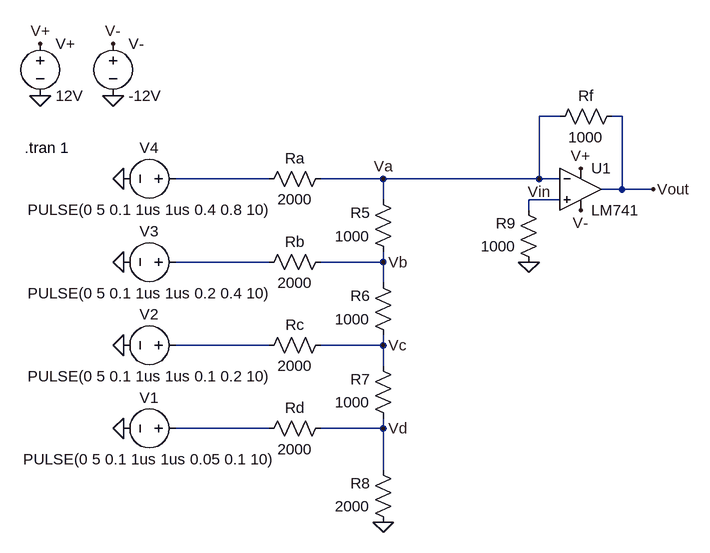
[diagram p0: schematic DAC_OpAmp.asc]
DAC_OpAmp.asc, the LTspice schematic file:
Version 4
SHEET 1 880 680
WIRE 560 -32 528 -32
WIRE 656 -32 640 -32
WIRE 112 64 -32 64
WIRE 288 64 192 64
WIRE 528 64 528 -32
WIRE 528 64 288 64
WIRE 560 64 528 64
WIRE 656 80 656 -32
WIRE 656 80 624 80
WIRE 704 80 656 80
WIRE 288 96 288 64
WIRE 560 96 512 96
WIRE 512 112 512 96
WIRE 112 192 -32 192
WIRE 288 192 288 176
WIRE 288 192 192 192
WIRE 288 224 288 192
WIRE 112 320 -32 320
WIRE 288 320 288 304
WIRE 288 320 192 320
WIRE 288 352 288 320
WIRE 112 448 -32 448
WIRE 288 448 288 432
WIRE 288 448 192 448
WIRE 288 512 288 448
FLAG 512 192 0
FLAG -240 -64 0
FLAG -128 -64 0
FLAG 288 592 0
FLAG -240 -144 V+
FLAG 592 48 V+
FLAG -128 -144 V-
FLAG 592 112 V-
FLAG 704 80 Vout
FLAG 288 64 Va
FLAG 288 192 Vb
FLAG 288 320 Vc
FLAG 288 448 Vd
FLAG -112 448 0
FLAG -112 320 0
FLAG -112 192 0
FLAG -112 64 0
FLAG 528 64 Vin
SYMBOL res 208 48 R90
WINDOW 0 0 56 VBottom 2
WINDOW 3 32 56 VTop 2
SYMATTR InstName Ra
SYMATTR Value 2000
SYMBOL res 208 176 R90
WINDOW 0 0 56 VBottom 2
WINDOW 3 32 56 VTop 2
SYMATTR InstName Rb
SYMATTR Value 2000
SYMBOL res 208 304 R90
WINDOW 0 0 56 VBottom 2
WINDOW 3 32 56 VTop 2
SYMATTR InstName Rc
SYMATTR Value 2000
SYMBOL res 208 432 R90
WINDOW 0 0 56 VBottom 2
WINDOW 3 32 56 VTop 2
SYMATTR InstName Rd
SYMATTR Value 2000
SYMBOL res 304 192 R180
WINDOW 0 36 76 Left 2
WINDOW 3 36 40 Left 2
SYMATTR InstName R5
SYMATTR Value 1000
SYMBOL res 304 320 R180
WINDOW 0 36 76 Left 2
WINDOW 3 36 40 Left 2
SYMATTR InstName R6
SYMATTR Value 1000
SYMBOL res 304 448 R180
WINDOW 0 36 76 Left 2
WINDOW 3 36 40 Left 2
SYMATTR InstName R7
SYMATTR Value 1000
SYMBOL res 304 608 R180
WINDOW 0 36 76 Left 2
WINDOW 3 36 40 Left 2
SYMATTR InstName R8
SYMATTR Value 2000
SYMBOL res 528 208 R180
WINDOW 0 36 76 Left 2
WINDOW 3 36 40 Left 2
SYMATTR InstName R9
SYMATTR Value 1000
SYMBOL res 544 -16 R270
WINDOW 0 32 56 VTop 2
WINDOW 3 0 56 VBottom 2
SYMATTR InstName Rf
SYMATTR Value 1000
SYMBOL Opamps\\LM741 592 16 R0
SYMATTR InstName U1
SYMBOL voltage -240 -160 R0
SYMATTR InstName V+
SYMATTR Value 12V
SYMBOL voltage -128 -160 R0
SYMATTR InstName V-
SYMATTR Value -12V
SYMBOL voltage -16 64 R90
WINDOW 0 -32 56 VBottom 2
WINDOW 3 32 56 VTop 2
SYMATTR InstName V4
SYMATTR Value PULSE(0 5 0.1 1us 1us 0.4 0.8 10)
SYMBOL voltage -16 192 R90
WINDOW 0 -32 56 VBottom 2
WINDOW 3 32 56 VTop 2
SYMATTR InstName V3
SYMATTR Value PULSE(0 5 0.1 1us 1us 0.2 0.4 10)
SYMBOL voltage -16 320 R90
WINDOW 0 -32 56 VBottom 2
WINDOW 3 32 56 VTop 2
WINDOW 123 0 0 Left 0
WINDOW 39 0 0 Left 0
SYMATTR InstName V2
SYMATTR Value PULSE(0 5 0.1 1us 1us 0.1 0.2 10)
SYMBOL voltage -16 448 R90
WINDOW 0 -32 56 VBottom 2
WINDOW 3 32 56 VTop 2
WINDOW 123 0 0 Left 0
WINDOW 39 0 0 Left 0
SYMATTR InstName V1
SYMATTR Value PULSE(0 5 0.1 1us 1us 0.05 0.1 10)
TEXT -264 16 Left 2 !.tran 1

The netlist it stands for:
* DAC_OpAmp.asc
Ra Vin N001 2000
Rb Vb N003 2000
Rc Vc N004 2000
Rd Vd N005 2000
R5 Vb Vin 1000
R6 Vc Vb 1000
R7 Vd Vc 1000
R8 0 Vd 2000
R9 0 N002 1000
Rf Vin Vout 1000
XU1 N002 Vin V+ V- Vout LM741  ; pins In+ In- V+ V- OUT
V+ V+ 0 12V
V- V- 0 -12V
V4 N001 0 PULSE(0 5 0.1 1us 1us 0.4 0.8 10)
V3 N003 0 PULSE(0 5 0.1 1us 1us 0.2 0.4 10)
V2 N004 0 PULSE(0 5 0.1 1us 1us 0.1 0.2 10)
V1 N005 0 PULSE(0 5 0.1 1us 1us 0.05 0.1 10)
.tran 1
.lib LM741.lib
.backanno
.end